# Altium schematic sheet PGA_CH1.SchDoc
size A; SheetNumber: 2; SheetTotal: 6
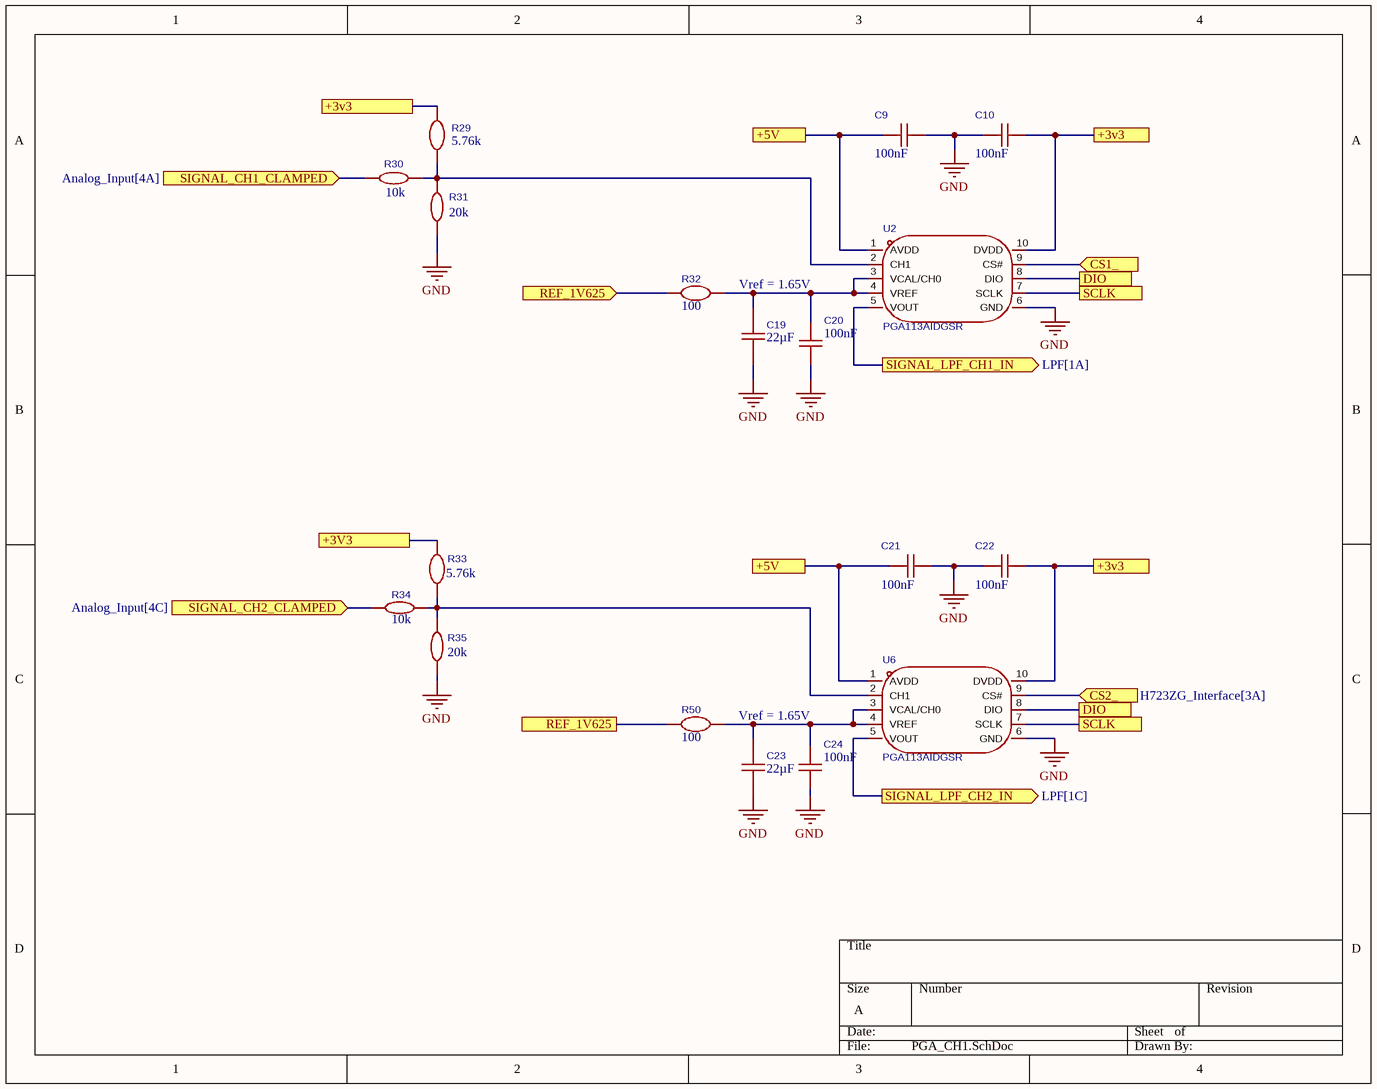
[diagram p0: PGA_CH1.SchDoc]

## Parts
C9  value 100nF  [C0805]  (hidden comment: 0805CG6R0C500NT_C67560)
C10  value 100nF  [C0805]  (hidden comment: 0805CG6R0C500NT_C67560)
C19  value 22µF  [C0805]  (hidden comment: TCC0805X5R226K100FT)
C20  value 100nF  [C0805]  (hidden comment: 0805CG6R0C500NT_C67560)
C21  value 100nF  [C0805]  (hidden comment: 0805CG6R0C500NT_C67560)
C22  value 100nF  [C0805]  (hidden comment: 0805CG6R0C500NT_C67560)
C23  value 22µF  [C0805]  (hidden comment: TCC0805X5R226K100FT)
C24  value 100nF  [C0805]  (hidden comment: 0805CG6R0C500NT_C67560)
R29  value 5.76k  [R0805]  (hidden comment: RT0805BRD0710K1L)
R30  value 10k  [R0805]  (hidden comment: 0805W8F0000T5E_C17477)
R31  value 20k  [R0805]  (hidden comment: 0805W8F0000T5E_C17477)
R32  value 100  [R0805]  (hidden comment: RT0805BRD0710K1L)
R33  value 5.76k  [R0805]  (hidden comment: RT0805BRD0710K1L)
R34  value 10k  [R0805]  (hidden comment: 0805W8F0000T5E_C17477)
R35  value 20k  [R0805]  (hidden comment: 0805W8F0000T5E_C17477)
R50  value 100  [R0805]  (hidden comment: RT0805BRD0710K1L)
U2  PGA113AIDGSR  [VSSOP-10_L3.0-W3.0-P0.50-LS4.9-BL]
U6  PGA113AIDGSR  [VSSOP-10_L3.0-W3.0-P0.50-LS4.9-BL]

## Ports
+3v3 (see H723ZG_Interface[1A], PGA_CH1[1A], PGA_CH1[1B], PGA_CH1[4A], REF_VOLTAGE_RELAY_DRIVER[1A], REF_VOLTAGE_RELAY_DRIVER[2B], REF_VOLTAGE_RELAY_DRIVER[2C], REF_VOLTAGE_RELAY_DRIVER[3A], Trigger[1C], Trigger[3A], Trigger[3B]), +3v3 (see H723ZG_Interface[1A], PGA_CH1[1A], PGA_CH1[1B], PGA_CH1[4C], REF_VOLTAGE_RELAY_DRIVER[1A], REF_VOLTAGE_RELAY_DRIVER[2B], REF_VOLTAGE_RELAY_DRIVER[2C], REF_VOLTAGE_RELAY_DRIVER[3A], Trigger[1C], Trigger[3A], Trigger[3B]), +3V3 (see H723ZG_Interface[1A], PGA_CH1[1A], PGA_CH1[4A], PGA_CH1[4C], REF_VOLTAGE_RELAY_DRIVER[1A], REF_VOLTAGE_RELAY_DRIVER[2B], REF_VOLTAGE_RELAY_DRIVER[2C], REF_VOLTAGE_RELAY_DRIVER[3A], Trigger[1C], Trigger[3A], Trigger[3B]), +3v3 (see H723ZG_Interface[1A], PGA_CH1[1B], PGA_CH1[4A], PGA_CH1[4C], REF_VOLTAGE_RELAY_DRIVER[1A], REF_VOLTAGE_RELAY_DRIVER[2B], REF_VOLTAGE_RELAY_DRIVER[2C], REF_VOLTAGE_RELAY_DRIVER[3A], Trigger[1C], Trigger[3A], Trigger[3B]), +5V (see H723ZG_Interface[1A], PGA_CH1[3A], REF_VOLTAGE_RELAY_DRIVER[2B], REF_VOLTAGE_RELAY_DRIVER[2C], Trigger[2B], Trigger[4A]), +5V (see H723ZG_Interface[1A], PGA_CH1[3C], REF_VOLTAGE_RELAY_DRIVER[2B], REF_VOLTAGE_RELAY_DRIVER[2C], Trigger[2B], Trigger[4A]), CS1_ (in, see H723ZG_Interface[3A]), CS2_ (in, see H723ZG_Interface[3A]), DIO (see H723ZG_Interface[3A], PGA_CH1[4B], Trigger[1C]), DIO (see H723ZG_Interface[3A], PGA_CH1[4C], Trigger[1C]), REF_1V625 (in, see PGA_CH1[2C], REF_VOLTAGE_RELAY_DRIVER[3A]), REF_1V625 (see PGA_CH1[2B], REF_VOLTAGE_RELAY_DRIVER[3A]), SCLK (see H723ZG_Interface[3A], PGA_CH1[4B], Trigger[1C]), SCLK (see H723ZG_Interface[3A], PGA_CH1[4C], Trigger[1C]), SIGNAL_CH1_CLAMPED (in, see Analog_Input[4A]), SIGNAL_CH2_CLAMPED (in, see Analog_Input[4C]), SIGNAL_LPF_CH1_IN (out, see LPF[1A]), SIGNAL_LPF_CH2_IN (out, see LPF[1C])

## Nets
GND: C9.1 C10.2 C19.2 C20.1 C21.1 C22.2 C23.2 C24.1 R31.2 R35.2 U2.6(GND) U6.6(GND)
+3v3: C10.1 C22.1 R29.1 R33.1 U2.10(DVDD) U6.10(DVDD) ; port +3v3, port +3V3
+5V: C9.2 C21.2 U2.1(AVDD) U6.1(AVDD) ; port +5V
CS1_: U2.9(CS#) ; port CS1_
CS2_: U6.9(CS#) ; port CS2_
DIO: U2.8(DIO) U6.8(DIO) ; port DIO
REF_1V625: R32.1 R50.1 ; port REF_1V625
SCLK: U2.7(SCLK) U6.7(SCLK) ; port SCLK
SIGNAL_CH1_CLAMPED: R30.2 ; port SIGNAL_CH1_CLAMPED
SIGNAL_CH2_CLAMPED: R34.2 ; port SIGNAL_CH2_CLAMPED
SIGNAL_LPF_CH1_IN: U2.5(VOUT) ; port SIGNAL_LPF_CH1_IN
SIGNAL_LPF_CH2_IN: U6.5(VOUT) ; port SIGNAL_LPF_CH2_IN
NetC19_1: C19.1 C20.2 R32.2 U2.3(VCAL/CH0) U2.4(VREF)
NetC23_1: C23.1 C24.2 R50.2 U6.3(VCAL/CH0) U6.4(VREF)
NetR29_2: R29.2 R30.1 R31.1 U2.2(CH1)
NetR33_2: R33.2 R34.1 R35.1 U6.2(CH1)

## Notes on the sheet
- Vref = 1.65V

## Library data of the parts
C9 C10 C20-C22 C24 = CMP-015-000003-2: Capacitance:100nF Tolerance:±5% Tolerance:±5% Voltage Rating:50V Temperature Coefficient:X7R; Manufacturer: YAGEO(国巨); AddInBom: yes; Device: CC0805JRX7R9BB104; ModelId: 8c88e81f49c6409b980720ec8953afb6聨0819f05c4eef4c71ace90d822a990e87; ModelName: C0805_L2.0-W1.3-H1.3; ModelTransform: 78.74,51.181,0,0,0,0,0,0.0005,0; Temperature Coefficient: X7R; Tolerance: 5%; Voltage Rating: 50V; ConvertToPcb: yes; Datasheet: https://item.szlcsc.com/datasheet/CC0805JRX7R9BB104/112720.html; Design Item ID: CC0805JRX7R9BB104; FootprintName: C0805; JLCPCB Part Class: Extended Part; LCSC Part Name: 100nF ±5% 50V; Source: P1.SCHLIB; Supplier Footprint: 0805; Symbol: CC0805JRX7R9BB104; Manufacturer Part Number: CC0805JRX7R9BB104; Supplier Part Number: C111492
C19 C23 = CMP-015-000005-1: Capacitance:22uF Tolerance:±10% Tolerance:±10% Voltage Rating:10V Temperature Coefficient:X5R; Manufacturer: CCTC(三环); AddInBom: yes; ModelId: 8c88e81f49c6409b980720ec8953afb6聨0819f05c4eef4c71ace90d822a990e87; ModelName: C0805_L2.0-W1.3-H1.3; ModelTransform: 78.74,51.181,0,0,0,0,0,0.0005,0; Temperature Coefficient: X5R; Tolerance: 10%; Voltage Rating: 10V; ConvertToPcb: yes; Datasheet: https://item.szlcsc.com/datasheet/TCC0805X5R226K100FT/352741.html; Design Item ID: TCC0805X5R226K100FT; Device: TCC0805X5R226K100FT; FootprintName: C0805; JLCPCB Part Class: Extended Part; LCSC Part Name: 22uF ±10% 10V; Source: P1.SCHLIB; Supplier Footprint: 0805; Symbol: TCC0805X5R226K100FT; Manufacturer Part Number: TCC0805X5R226K100FT; Supplier Part Number: C380336
R29 R33 = CMP-016-000013-1: Type:Thick Film Resistor Resistance:5.76kΩ Tolerance:±1% Tolerance:±1% Power(Watts):125mW Voltage-Supply(Max):150V Temperature Coefficient:±100ppm/℃ Temperature Coefficient:±100ppm/℃ Operating Temperature:-55℃~+155℃ Operating Temperature:-55℃~+155℃; Manufacturer: FOJAN(富捷); AddInBom: yes; Device: FRC0805F5761TS; ModelId: b83c7c5430874b8eb2319a65d9433429聨0819f05c4eef4c71ace90d822a990e87; ModelName: R0805_L2.0-W1.3-H0.6; ModelTransform: 78.74,51.181,0,0,0,0,0,-0.0005,0; Power(Watts): 125mW; Tolerance: 1%; Voltage-Supply(Max): 150V; ConvertToPcb: yes; Design Item ID: FRC0805F5761TS; FootprintName: R0805; JLCPCB Part Class: Extended Part; LCSC Part Name: 5.76kΩ ±1% 125mW 厚膜电阻; Operating Temperature: -55℃~+155℃; Source: P1.SCHLIB; Supplier Footprint: 0805; Symbol: FRC0805F5761TS; Temperature Coefficient: ±100ppm/℃; Type: Thick Film Resistor; Manufacturer Part Number: FRC0805F5761TS; Supplier Part Number: C3000533
R30 R34 = CMP-016-000002-1: Type:Thick Film Resistor Resistance:10kΩ Tolerance:±1% Tolerance:±1% Power(Watts):125mW Voltage-Supply(Max):150V Temperature Coefficient:±100ppm/℃ Temperature Coefficient:±100ppm/℃ Operating Temperature:-55℃~+155℃ Operating Temperature:-55℃~+155℃; Manufacturer: UNI-ROYAL(厚声); AddInBom: yes; Device: 0805W8F1002T5E; ModelId: b83c7c5430874b8eb2319a65d9433429聨0819f05c4eef4c71ace90d822a990e87; ModelName: R0805_L2.0-W1.3-H0.6; ModelTransform: 78.74,51.181,0,0,0,0,0,-0.0005,0; Power(Watts): 125mW; Tolerance: 1%; Voltage-Supply(Max): 150V; ConvertToPcb: yes; Datasheet: https://item.szlcsc.com/datasheet/0805W8F1002T5E/18102.html; Design Item ID: 0805W8F1002T5E; FootprintName: R0805; JLCPCB Part Class: Basic Part; LCSC Part Name: 10kΩ ±1% 125mW 厚膜电阻; Operating Temperature: -55℃~+155℃; Source: P1.SCHLIB; Supplier Footprint: 0805; Symbol: 0805W8F1002T5E; Temperature Coefficient: ±100ppm/℃; Type: Thick Film Resistor; Manufacturer Part Number: 0805W8F1002T5E; Supplier Part Number: C17414
R31 R35 = CMP-016-000005-1: Type:Thick Film Resistors Resistance:20kΩ Tolerance:±1% Tolerance:±1% Power(Watts): Overload Voltage (Max): Temperature Coefficient:±100ppm/℃ Temperature Coefficient:±100ppm/℃ Operating Temperature Range:-55℃~+155℃ Operating Temperature Range:-55℃~+155℃; Manufacturer: UNI-ROYAL(厚声); AddInBom: yes; Device: 0805W8F2002T5E; ModelId: b83c7c5430874b8eb2319a65d9433429聨0819f05c4eef4c71ace90d822a990e87; ModelName: R0805_L2.0-W1.3-H0.6; ModelTransform: 78.74,51.181,0,0,0,0,0,-0.0005,0; Tolerance: 1%; ConvertToPcb: yes; Datasheet: https://atta.szlcsc.com/upload/public/pdf/source/20200306/C422600_1E6D84923E4A46A82E41ADD87F860B5C.pdf; Design Item ID: 0805W8F2002T5E; FootprintName: R0805; JLCPCB Part Class: Basic Part; LCSC Part Name: 20kΩ ±1% 125mW 厚膜电阻; Operating Temperature Range: -55℃~+155℃; Source: P1.SCHLIB; Supplier Footprint: 0805; Symbol: 0805W8F2002T5E; Temperature Coefficient: ±100ppm/℃; Type: Thick Film Resistors; Manufacturer Part Number: 0805W8F2002T5E; Supplier Part Number: C4328
R32 R50 = CMP-016-000006-1: Type:Thick Film Resistor Resistance:100Ω Tolerance:±1% Tolerance:±1% Power(Watts):125mW Voltage-Supply(Max):150V Temperature Coefficient:±100ppm/℃ Temperature Coefficient:±100ppm/℃ Operating Temperature:-55℃~+155℃ Operating Temperature:-55℃~+155℃; Manufacturer: FOJAN(富捷); AddInBom: yes; Device: FRC0805F1000TS; ModelId: b83c7c5430874b8eb2319a65d9433429聨0819f05c4eef4c71ace90d822a990e87; ModelName: R0805_L2.0-W1.3-H0.6; ModelTransform: 78.74,51.181,0,0,0,0,0,-0.0005,0; Power(Watts): 125mW; Tolerance: 1%; Voltage-Supply(Max): 150V; ConvertToPcb: yes; Datasheet: https://item.szlcsc.com/datasheet/FRC0805F1000TS/3180731.html; Design Item ID: FRC0805F1000TS; FootprintName: R0805; JLCPCB Part Class: Extended Part; LCSC Part Name: 100Ω ±1% 125mW 厚膜电阻; Operating Temperature: -55℃~+155℃; Source: P1.SCHLIB; Supplier Footprint: 0805; Symbol: FRC0805F1000TS; Temperature Coefficient: ±100ppm/℃; Type: Thick Film Resistor; Manufacturer Part Number: FRC0805F1000TS; Supplier Part Number: C2907218
U2 U6 = CMP-008-000000-1: Amplifier Type:PGA Number of Channels:2 Rail to Rail:Rail-to-Rail Input；Rail-to-Rail Output Output Current:60mA Current - Supply:1.1mA Operating Temperature:-40℃~+125℃ Operating Temperature:-40℃~+125℃ Vos - Input Offset Voltage:100uV Input Offset Voltage; Manufacturer: TI(德州仪器); ModelId: 3e31ed6b36ca484795e6a68c51b575dc聨0819f05c4eef4c71ace90d822a990e87; Input Offset Current(Ios): 5nA; ModelName: VSSOP-10_L3.0-W3.0-H1.1-LS4.9-P0.50; ConvertToPcb: yes; Input Offset Voltage Drift(Vos TC): 1.2uV/℃; ModelTransform: 197.637,118.11,0,90,0,0,0,0,0; Quiescent Current: 1100000nA; Ib - Input Bias Current: 5000pA; Output Current: 60mA; Number of Channels: 2; Amplifier Type: PGA; Single Supply: 2.2V~5.5V; Current - Supply: 1.1mA; Vos - Input Offset Voltage: 100uV; LCSC Part Name: 零漂移可编程增益放大器; JLCPCB Part Class: Extended Part; Symbol: PGA113AIDGSR; FootprintName: VSSOP-10_L3.0-W3.0-P0.50-LS4.9-BL; Rail to Rail: Rail-to-Rail Input；Rail-to-Rail Output; Design Item ID: PGA113AIDGSR; Source: PGA113AIDGSR.SCHLIB; Supplier Footprint: VSSOP-10-0.5mm; Operating Temperature: -40℃~+125℃; Datasheet: https://www.ti.com/cn/lit/gpn/pga112; AddInBom: yes; Device: PGA113AIDGSR; Manufacturer Part Number: PGA113AIDGSR; Supplier Part Number: C2057394